# EAGLE design ir led (EAGLE 9.6.2)
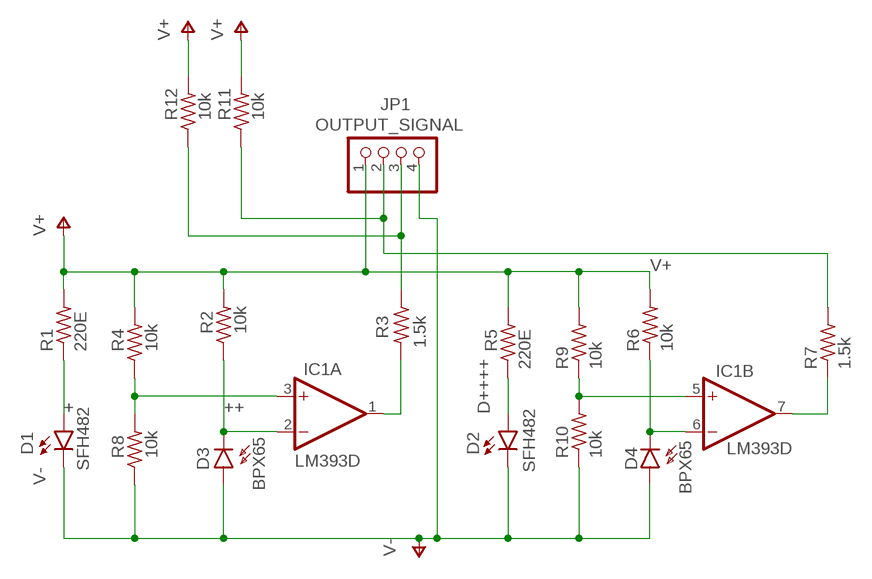
[diagram p0: schematic, sheet 1]

## Parts
D1  SFH482  [SFH482]
D2  SFH482  [SFH482]
D3  BPX65  [BPX65]
D4  BPX65  [BPX65]
IC1  LM393D  [SO08]
JP1  OUTPUT_SIGNAL  PINHD-1X4  [1X04]
R1  220E  R-US_0204/7  [0204/7]
R2  10k  R-US_0204/7  [0204/7]
R3  1.5k  R-US_0204/7  [0204/7]
R4  10k  R-US_0204/7  [0204/7]
R5  220E  R-US_0204/7  [0204/7]
R6  10k  R-US_0204/7  [0204/7]
R7  1.5k  R-US_0204/7  [0204/7]
R8  10k  R-US_0204/7  [0204/7]
R9  10k  R-US_0204/7  [0204/7]
R10  10k  R-US_0204/7  [0204/7]
R11  10k  R-US_0204/7  [0204/7]
R12  10k  R-US_0204/7  [0204/7]

## Nets
+: D1.A R1.1
++: D3.K(C) IC1.2(A:-IN) R2.1
D++++: D2.A R5.1
N$1: IC1.3(A:+IN) R4.1 R8.2
N$2: IC1.5(B:+IN) R9.1 R10.2
N$5: IC1.1(A:OUT) R3.2
N$8: IC1.7(B:OUT) R7.1
N$9: D4.K(C) IC1.6(B:-IN) R6.1
N$10: JP1.3 R3.1 R12.1
N$11: JP1.2 R7.2 R11.1
V+: JP1.1 R1.2 R2.2 R4.2 R5.2 R6.2 R9.2 R11.2 R12.2
V-: D1.K(C) D2.K(C) D3.A D4.A JP1.4 R8.1 R10.1

## Power pins joined to a net without a drawn wire
V+: IC1.8(P:V+)
V-: IC1.4(P:V-)

## Library data of the parts
D1 D2 = led:SFH482: IR LED infrared emitting diode, Infineon
D3 D4 = opto-trans-siemens:BPX65: PHOTO DIODE; MPN: BPX65.; OC_FARNELL: 327451; OC_NEWARK: 06WX2764
IC1 = linear:LM393: COMPARATOR
JP1 = pinhead:PINHD-1X4: PIN HEADER
R1-R12 = rcl:R-US_: RESISTOR, American symbol; SPICEPREFIX: R

## Board
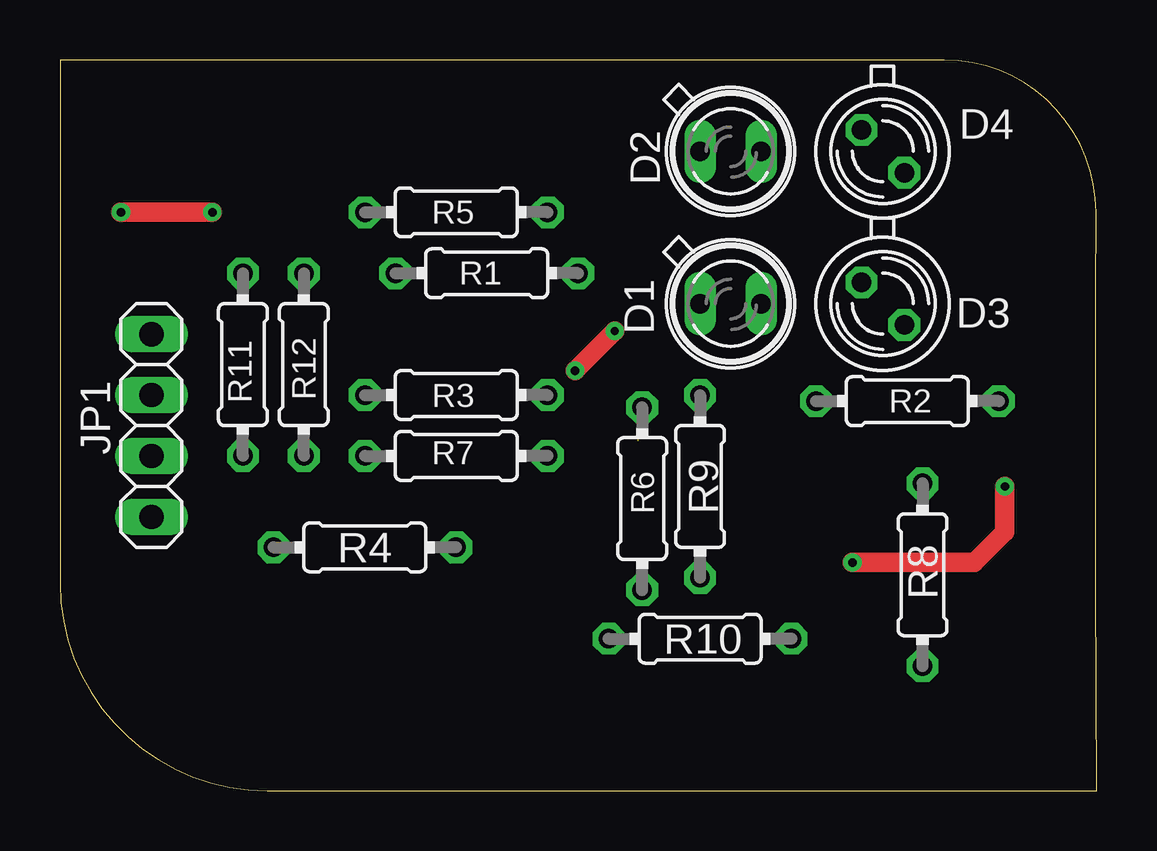
[diagram p1: board, top side]
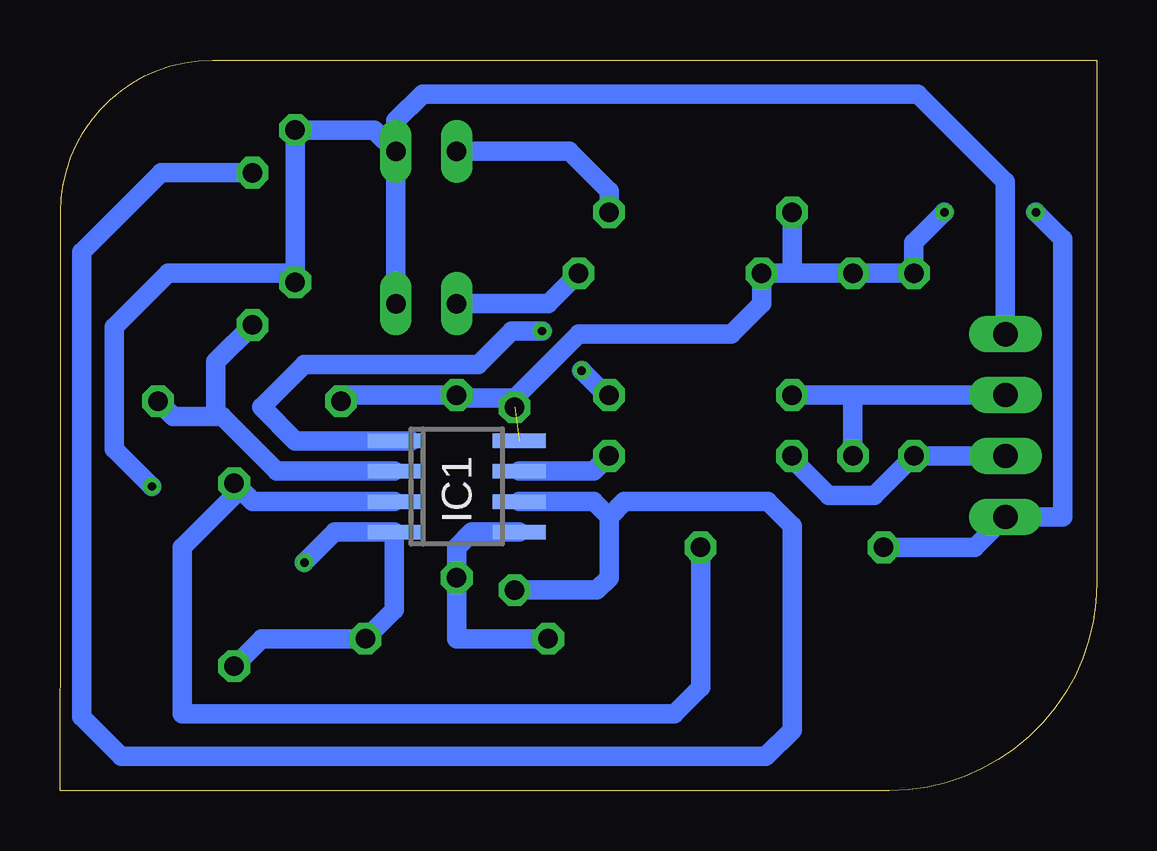
[diagram p2: board, bottom side, seen from below]

Size 43.2 x 30.46 mm. Coordinates in mm from the lower left corner, seen from the top.
Outline: 0,30.46 0,8.64 arc90 8.64,0 43.2,0 43.16,8.54 43.16,20.63 43.17,24.12 arc90 36.84,30.46 0,30.46
Copper layers (1*16): Top 0.035mm / dielectric 1.5mm / Bottom 0.035mm
Design rules "default": minimum track width 6mil, minimum drill 0.35mm, track to track 6mil, track to pad 6mil, pad to pad 6mil, via to via 6mil, smd to smd 6mil, copper to edge 40mil, drill to drill 6mil, minimum pad ring 10mil, minimum via ring 8mil, stop-mask expansion 4mil, vias tented up to drill 0mil, thermal gap 10mil

### Footprints (pad centres in the part's own frame; a part is rotated, then mirrored left to right if it is on the bottom)
SFH482 = drill 0.813 long: A -1.27,0; K 1.27,0
BPX65 = drill 0.813 octagon: A -0.889,-0.889; K 0.889,0.889
SO08 = smd 0.6 x 2.2: 1 -1.905,-2.6; 2 -0.635,-2.6; 3 0.635,-2.6; 4 1.905,-2.6; 5 1.905,2.6; 6 0.635,2.6; 7 -0.635,2.6; 8 -1.905,2.6
1X04 = drill 1.016 long: 1 -3.81,0; 2 -1.27,0; 3 1.27,0; 4 3.81,0
0204/7 = drill 0.813 octagon: 1 -3.81,0; 2 3.81,0

### Placement (x,y rotation side)
D1  27.94,20.3 0 top
D2  27.94,26.65 0 top
D3  34.29,20.3 270 top
D4  34.29,26.65 270 top
IC1  26.67,12.68 270 bottom
JP1  3.81,15.22 90 top
R1  17.78,21.57 180 top
R2  35.31,16.24 180 top
R3  16.51,16.49 0 top
R4  12.7,10.14 180 top
R5  16.51,24.11 180 top
R6  24.26,12.17 90 top
R7  16.51,13.95 180 top
R8  35.94,9 90 top
R9  26.67,12.68 90 top
R10  26.67,6.33 180 top
R11  7.62,17.76 90 top
R12  10.16,17.76 90 top

### Tracks (layer width: path | path; a pad name or v marks a point on that pad's centre or on a via)
+
  Bottom 0.813: R1.1 22.86,20.3 D1.A
++
  Bottom 0.813: R2.1 38.48,15.6 36.7,15.6 | IC1.2 34.16,13.32 36.45,15.6 36.7,15.6 | D3.K 36.7,17.89 36.7,15.6
D++++
  Bottom 0.813: R5.1 20.32,25 21.97,26.65 D2.A
N$1
  Bottom 0.813: IC1.3 35.18,12.04 R8.2 35.94,12.3 38.1,10.14 38.1,3.2 17.61,3.2 16.51,4.3 R4.1
N$2
  Bottom 0.813: IC1.5 26.04,10.78 26.67,10.14 R9.1 26.67,6.33 R10.2
N$5  (via drill 0.35)
  Top 0.813: v23.11,19.16 v21.46,17.51
  Bottom 0.813: v23.11,19.16 24.38,19.16 25.78,17.76 33.02,17.76 34.8,15.98 33.4,14.59 IC1.1 28.57,14.59 | v21.46,17.51 20.45,16.49 R3.2
N$8
  Bottom 0.813: R7.1 20.95,13.32 IC1.7
N$9
  Bottom 0.813: R6.1 20.83,8.36 20.32,8.87 20.32,11.41 | 20.32,11.41 20.95,12.04 IC1.6 | 20.32,11.41 19.68,12.04 13.72,12.04 12.7,11.03 12.7,2.52 13.8,1.42 40.64,1.42 42.29,3.07 42.29,22.46 38.99,25.76 D4.K
N$10
  Bottom 0.813: JP1.3 10.16,16.49 | 10.16,16.49 R3.1 | R12.1 10.16,16.49
N$11
  Bottom 0.813: JP1.2 R11.1 9.27,12.3 11.18,12.3 12.7,13.82 R7.2
V+  (via drill 0.35)  (1 unrouted)
  Top 0.813: v2.54,24.11 v6.35,24.11
  Bottom 0.813: 24.26,16.36 R6.2 | 24.26,16.36 21.59,19.03 15.24,19.03 13.97,20.3 R1.2 12.7,21.57 | 24.26,16.36 26.54,16.36 R9.2 31.24,16.49 R2.2 | 12.7,21.57 R12.2 R11.2 7.62,22.84 v6.35,24.11 | R5.2 12.7,21.57 | R4.2 5.08,10.14 JP1.1 1.42,11.41 1.42,22.99 v2.54,24.11
V-  (via drill 0.35)
  Top 0.813: v39.37,12.68 39.37,10.78 38.1,9.51 v33.02,9.51
  Bottom 0.813: JP1.4 3.81,25.38 7.47,29.04 28.09,29.04 29.21,27.92 D2.K | D2.K 30.1,27.54 D4.A 33.4,21.57 | D1.K D2.K | 33.4,21.57 D3.A | R8.1 34.8,6.33 R10.1 29.27,7.54 IC1.4 31.75,10.78 v33.02,9.51 | 33.4,21.57 38.69,21.57 40.94,19.32 40.94,14.25 v39.37,12.68